# Altium schematic sheet 03 ZYNQ_PL-BANK34-35.SchDoc
size A4
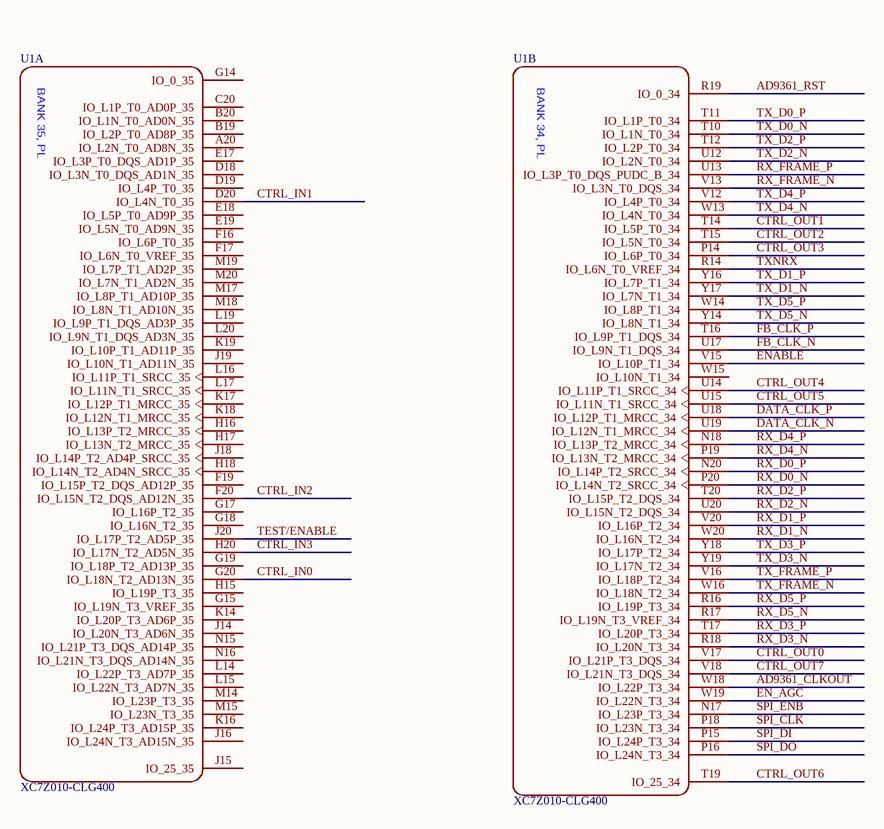
[diagram p0: 03 ZYNQ_PL-BANK34-35.SchDoc]

## Parts
U1  XC7Z010-CLG400  [CLG400-0.8]  (parts A,B of 8)

## Nets
AD9361_CLKOUT: U1.W18(IO_L22P_T3_34)
AD9361_RST: U1.R19(IO_0_34)
CTRL_IN0: U1.G20(IO_L18N_T2_AD13N_35)
CTRL_IN1: U1.D20(IO_L4N_T0_35)
CTRL_IN2: U1.F20(IO_L15N_T2_DQS_AD12N_35)
CTRL_IN3: U1.H20(IO_L17N_T2_AD5N_35)
CTRL_OUT0: U1.V17(IO_L21P_T3_DQS_34)
CTRL_OUT1: U1.T14(IO_L5P_T0_34)
CTRL_OUT2: U1.T15(IO_L5N_T0_34)
CTRL_OUT3: U1.P14(IO_L6P_T0_34)
CTRL_OUT4: U1.U14(IO_L11P_T1_SRCC_34)
CTRL_OUT5: U1.U15(IO_L11N_T1_SRCC_34)
CTRL_OUT6: U1.T19(IO_25_34)
CTRL_OUT7: U1.V18(IO_L21N_T3_DQS_34)
DATA_CLK_N: U1.U19(IO_L12N_T1_MRCC_34)
DATA_CLK_P: U1.U18(IO_L12P_T1_MRCC_34)
EN_AGC: U1.W19(IO_L22N_T3_34)
ENABLE: U1.V15(IO_L10P_T1_34)
FB_CLK_N: U1.U17(IO_L9N_T1_DQS_34)
FB_CLK_P: U1.T16(IO_L9P_T1_DQS_34)
RX_D0_N: U1.P20(IO_L14N_T2_SRCC_34)
RX_D0_P: U1.N20(IO_L14P_T2_SRCC_34)
RX_D1_N: U1.W20(IO_L16N_T2_34)
RX_D1_P: U1.V20(IO_L16P_T2_34)
RX_D2_N: U1.U20(IO_L15N_T2_DQS_34)
RX_D2_P: U1.T20(IO_L15P_T2_DQS_34)
RX_D3_N: U1.R18(IO_L20N_T3_34)
RX_D3_P: U1.T17(IO_L20P_T3_34)
RX_D4_N: U1.P19(IO_L13N_T2_MRCC_34)
RX_D4_P: U1.N18(IO_L13P_T2_MRCC_34)
RX_D5_N: U1.R17(IO_L19N_T3_VREF_34)
RX_D5_P: U1.R16(IO_L19P_T3_34)
RX_FRAME_N: U1.V13(IO_L3N_T0_DQS_34)
RX_FRAME_P: U1.U13(IO_L3P_T0_DQS_PUDC_B_34)
SPI_CLK: U1.P18(IO_L23N_T3_34)
SPI_DI: U1.P15(IO_L24P_T3_34)
SPI_DO: U1.P16(IO_L24N_T3_34)
SPI_ENB: U1.N17(IO_L23P_T3_34)
TEST/ENABLE: U1.J20(IO_L17P_T2_AD5P_35)
TX_D0_N: U1.T10(IO_L1N_T0_34)
TX_D0_P: U1.T11(IO_L1P_T0_34)
TX_D1_N: U1.Y17(IO_L7N_T1_34)
TX_D1_P: U1.Y16(IO_L7P_T1_34)
TX_D2_N: U1.U12(IO_L2N_T0_34)
TX_D2_P: U1.T12(IO_L2P_T0_34)
TX_D3_N: U1.Y19(IO_L17N_T2_34)
TX_D3_P: U1.Y18(IO_L17P_T2_34)
TX_D4_N: U1.W13(IO_L4N_T0_34)
TX_D4_P: U1.V12(IO_L4P_T0_34)
TX_D5_N: U1.Y14(IO_L8N_T1_34)
TX_D5_P: U1.W14(IO_L8P_T1_34)
TX_FRAME_N: U1.W16(IO_L18N_T2_34)
TX_FRAME_P: U1.V16(IO_L18P_T2_34)
TXNRX: U1.R14(IO_L6N_T0_VREF_34)

Not connected (* = marked no-connect by the designer): U1 A20(IO_L2N_T0_AD8N_35) B19(IO_L2P_T0_AD8P_35) B20(IO_L1N_T0_AD0N_35) C20(IO_L1P_T0_AD0P_35) D18(IO_L3N_T0_DQS_AD1N_35) D19(IO_L4P_T0_35) E17(IO_L3P_T0_DQS_AD1P_35) E18(IO_L5P_T0_AD9P_35) E19(IO_L5N_T0_AD9N_35) F16(IO_L6P_T0_35) F17(IO_L6N_T0_VREF_35) F19(IO_L15P_T2_DQS_AD12P_35) G14(IO_0_35) G15(IO_L19N_T3_VREF_35) G17(IO_L16P_T2_35) G18(IO_L16N_T2_35) G19(IO_L18P_T2_AD13P_35) H15(IO_L19P_T3_35) H16(IO_L13P_T2_MRCC_35) H17(IO_L13N_T2_MRCC_35) H18(IO_L14N_T2_AD4N_SRCC_35) J14(IO_L20N_T3_AD6N_35) J15(IO_25_35) J16(IO_L24N_T3_AD15N_35) J18(IO_L14P_T2_AD4P_SRCC_35) J19(IO_L10N_T1_AD11N_35) K14(IO_L20P_T3_AD6P_35) K16(IO_L24P_T3_AD15P_35) K17(IO_L12P_T1_MRCC_35) K18(IO_L12N_T1_MRCC_35) K19(IO_L10P_T1_AD11P_35) L14(IO_L22P_T3_AD7P_35) L15(IO_L22N_T3_AD7N_35) L16(IO_L11P_T1_SRCC_35) L17(IO_L11N_T1_SRCC_35) L19(IO_L9P_T1_DQS_AD3P_35) L20(IO_L9N_T1_DQS_AD3N_35) M14(IO_L23P_T3_35) M15(IO_L23N_T3_35) M17(IO_L8P_T1_AD10P_35) M18(IO_L8N_T1_AD10N_35) M19(IO_L7P_T1_AD2P_35) M20(IO_L7N_T1_AD2N_35) N15(IO_L21P_T3_DQS_AD14P_35) N16(IO_L21N_T3_DQS_AD14N_35) W15(IO_L10N_T1_34)

## Notes on the sheet
- (in symbol XC7Z010-CLG400, part A) BANK 35, PL
- (in symbol XC7Z010-CLG400, part B) BANK 34, PL